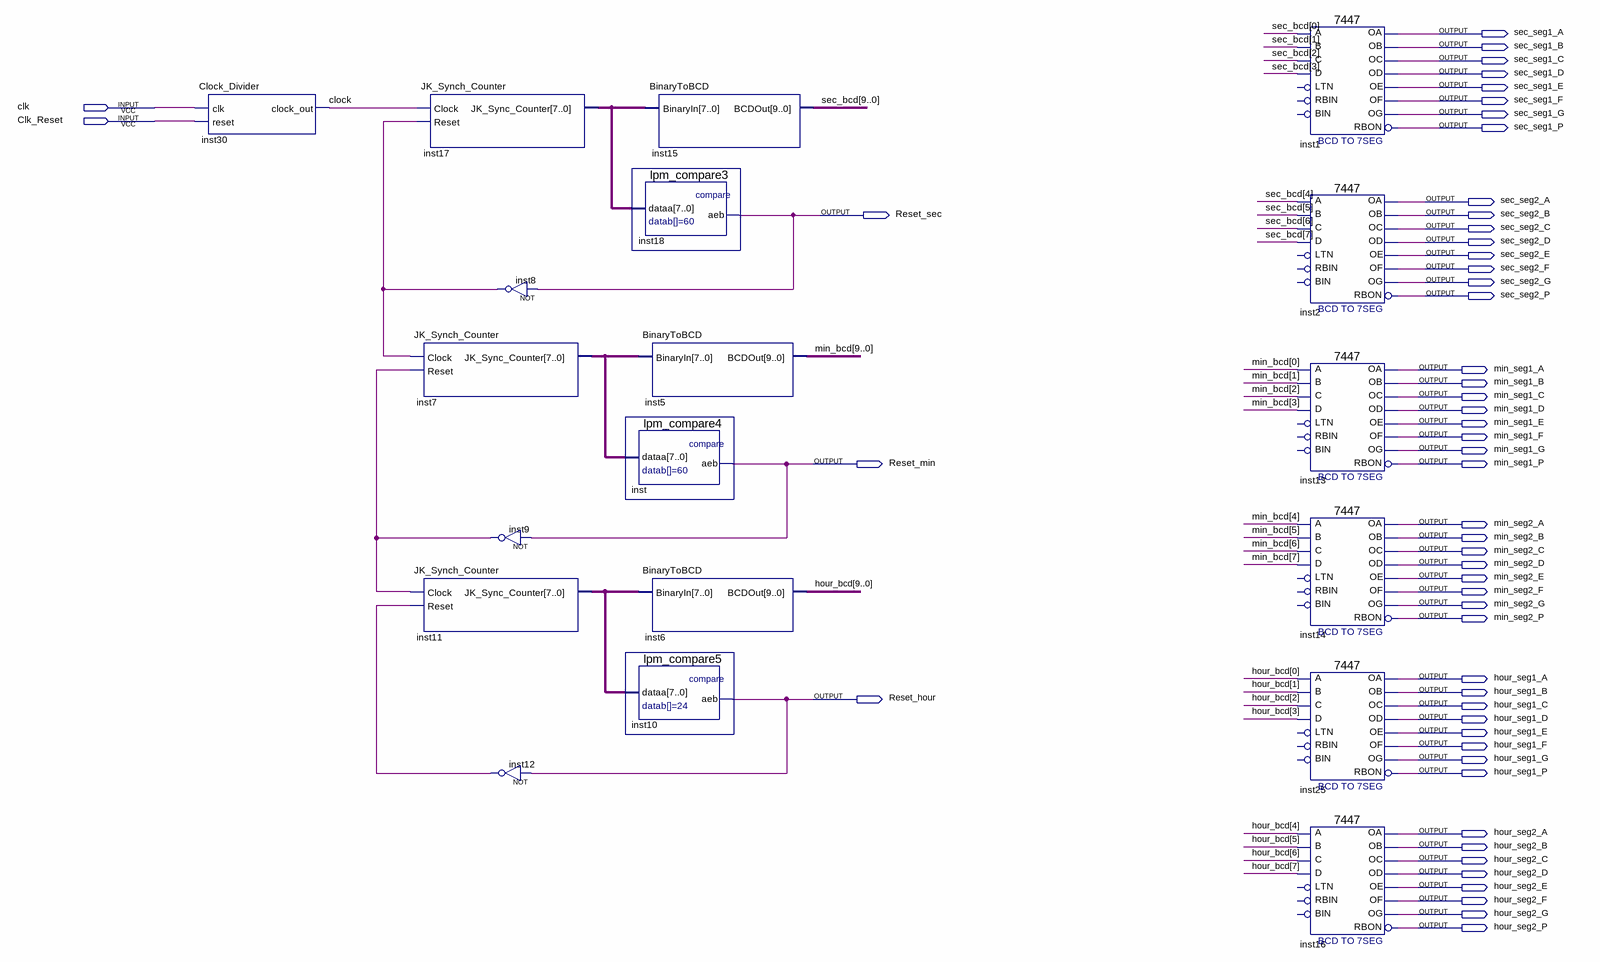
[diagram p0: schematic sheet]
// Quartus schematic main.bdf as structural Verilog: 19 symbols, 53 pins
module main (
  input  clk,
  input  Clk_Reset,
  output sec_seg1_A,
  output sec_seg1_B,
  output sec_seg1_C,
  output sec_seg1_D,
  output sec_seg1_E,
  output sec_seg1_F,
  output sec_seg1_G,
  output sec_seg1_P,
  output sec_seg2_A,
  output Reset_sec,
  output sec_seg2_B,
  output sec_seg2_C,
  output sec_seg2_D,
  output sec_seg2_E,
  output sec_seg2_F,
  output sec_seg2_G,
  output sec_seg2_P,
  output min_seg1_A,
  output min_seg1_B,
  output min_seg1_C,
  output min_seg1_D,
  output min_seg1_E,
  output min_seg1_F,
  output min_seg1_G,
  output Reset_min,
  output min_seg1_P,
  output min_seg2_A,
  output min_seg2_B,
  output min_seg2_C,
  output min_seg2_D,
  output min_seg2_E,
  output min_seg2_F,
  output min_seg2_G,
  output min_seg2_P,
  output hour_seg1_A,
  output hour_seg1_B,
  output Reset_hour,
  output hour_seg1_C,
  output hour_seg1_D,
  output hour_seg1_E,
  output hour_seg1_F,
  output hour_seg1_G,
  output hour_seg1_P,
  output hour_seg2_A,
  output hour_seg2_B,
  output hour_seg2_C,
  output hour_seg2_D,
  output hour_seg2_E,
  output hour_seg2_F,
  output hour_seg2_G,
  output hour_seg2_P
);

  wire clock, inst8_out, inst9_out, inst12_out;
  wire [7:0] inst7_jk_sync_counter, inst11_jk_sync_counter, inst17_jk_sync_counter;
  wire [9:0] hour_bcd, min_bcd, sec_bcd;

  Clock_Divider inst30 (.clk(clk), .reset(Clk_Reset), .clock_out(clock));
  JK_Synch_Counter inst17 (.Clock(clock), .Reset(inst8_out), .JK_Sync_Counter(inst17_jk_sync_counter));
  JK_Synch_Counter inst7 (.Clock(inst8_out), .Reset(inst9_out), .JK_Sync_Counter(inst7_jk_sync_counter));
  JK_Synch_Counter inst11 (.Clock(inst9_out), .Reset(inst12_out), .JK_Sync_Counter(inst11_jk_sync_counter));
  not inst8 (inst8_out, Reset_sec);
  not inst9 (inst9_out, Reset_min);
  not inst12 (inst12_out, Reset_hour);
  lpm_compare3 inst18 (.dataa(inst17_jk_sync_counter), .aeb(Reset_sec));
  lpm_compare4 inst (.dataa(inst7_jk_sync_counter), .aeb(Reset_min));
  lpm_compare5 inst10 (.dataa(inst11_jk_sync_counter), .aeb(Reset_hour));
  BinaryToBCD inst15 (.BinaryIn(inst17_jk_sync_counter), .BCDOut(sec_bcd));
  BinaryToBCD inst5 (.BinaryIn(inst7_jk_sync_counter), .BCDOut(min_bcd));
  BinaryToBCD inst6 (.BinaryIn(inst11_jk_sync_counter), .BCDOut(hour_bcd));
  \7447  inst1 (
    .B(sec_bcd[1]), .C(sec_bcd[2]), .D(sec_bcd[3]), .A(sec_bcd[0]), .OB(sec_seg1_B), .OC(sec_seg1_C),
    .OE(sec_seg1_E), .OD(sec_seg1_D), .OF(sec_seg1_F), .OG(sec_seg1_G), .OA(sec_seg1_A), .RBON(sec_seg1_P));  // open: LTN, RBIN, BIN
  \7447  inst2 (
    .B(sec_bcd[5]), .C(sec_bcd[6]), .D(sec_bcd[7]), .A(sec_bcd[4]), .OB(sec_seg2_B), .OC(sec_seg2_C),
    .OE(sec_seg2_E), .OD(sec_seg2_D), .OF(sec_seg2_F), .OG(sec_seg2_G), .OA(sec_seg2_A), .RBON(sec_seg2_P));  // open: LTN, RBIN, BIN
  \7447  inst13 (
    .B(min_bcd[1]), .C(min_bcd[2]), .D(min_bcd[3]), .A(min_bcd[0]), .OB(min_seg1_B), .OC(min_seg1_C),
    .OE(min_seg1_E), .OD(min_seg1_D), .OF(min_seg1_F), .OG(min_seg1_G), .OA(min_seg1_A), .RBON(min_seg1_P));  // open: LTN, RBIN, BIN
  \7447  inst14 (
    .B(min_bcd[5]), .C(min_bcd[6]), .D(min_bcd[7]), .A(min_bcd[4]), .OB(min_seg2_B), .OC(min_seg2_C),
    .OE(min_seg2_E), .OD(min_seg2_D), .OF(min_seg2_F), .OG(min_seg2_G), .OA(min_seg2_A), .RBON(min_seg2_P));  // open: LTN, RBIN, BIN
  \7447  inst25 (
    .B(hour_bcd[1]), .C(hour_bcd[2]), .D(hour_bcd[3]), .A(hour_bcd[0]), .OB(hour_seg1_B), .OC(hour_seg1_C),
    .OE(hour_seg1_E), .OD(hour_seg1_D), .OF(hour_seg1_F), .OG(hour_seg1_G), .OA(hour_seg1_A),
    .RBON(hour_seg1_P));  // open: LTN, RBIN, BIN
  \7447  inst16 (
    .B(hour_bcd[5]), .C(hour_bcd[6]), .D(hour_bcd[7]), .A(hour_bcd[4]), .OB(hour_seg2_B), .OC(hour_seg2_C),
    .OE(hour_seg2_E), .OD(hour_seg2_D), .OF(hour_seg2_F), .OG(hour_seg2_G), .OA(hour_seg2_A),
    .RBON(hour_seg2_P));  // open: LTN, RBIN, BIN
endmodule
